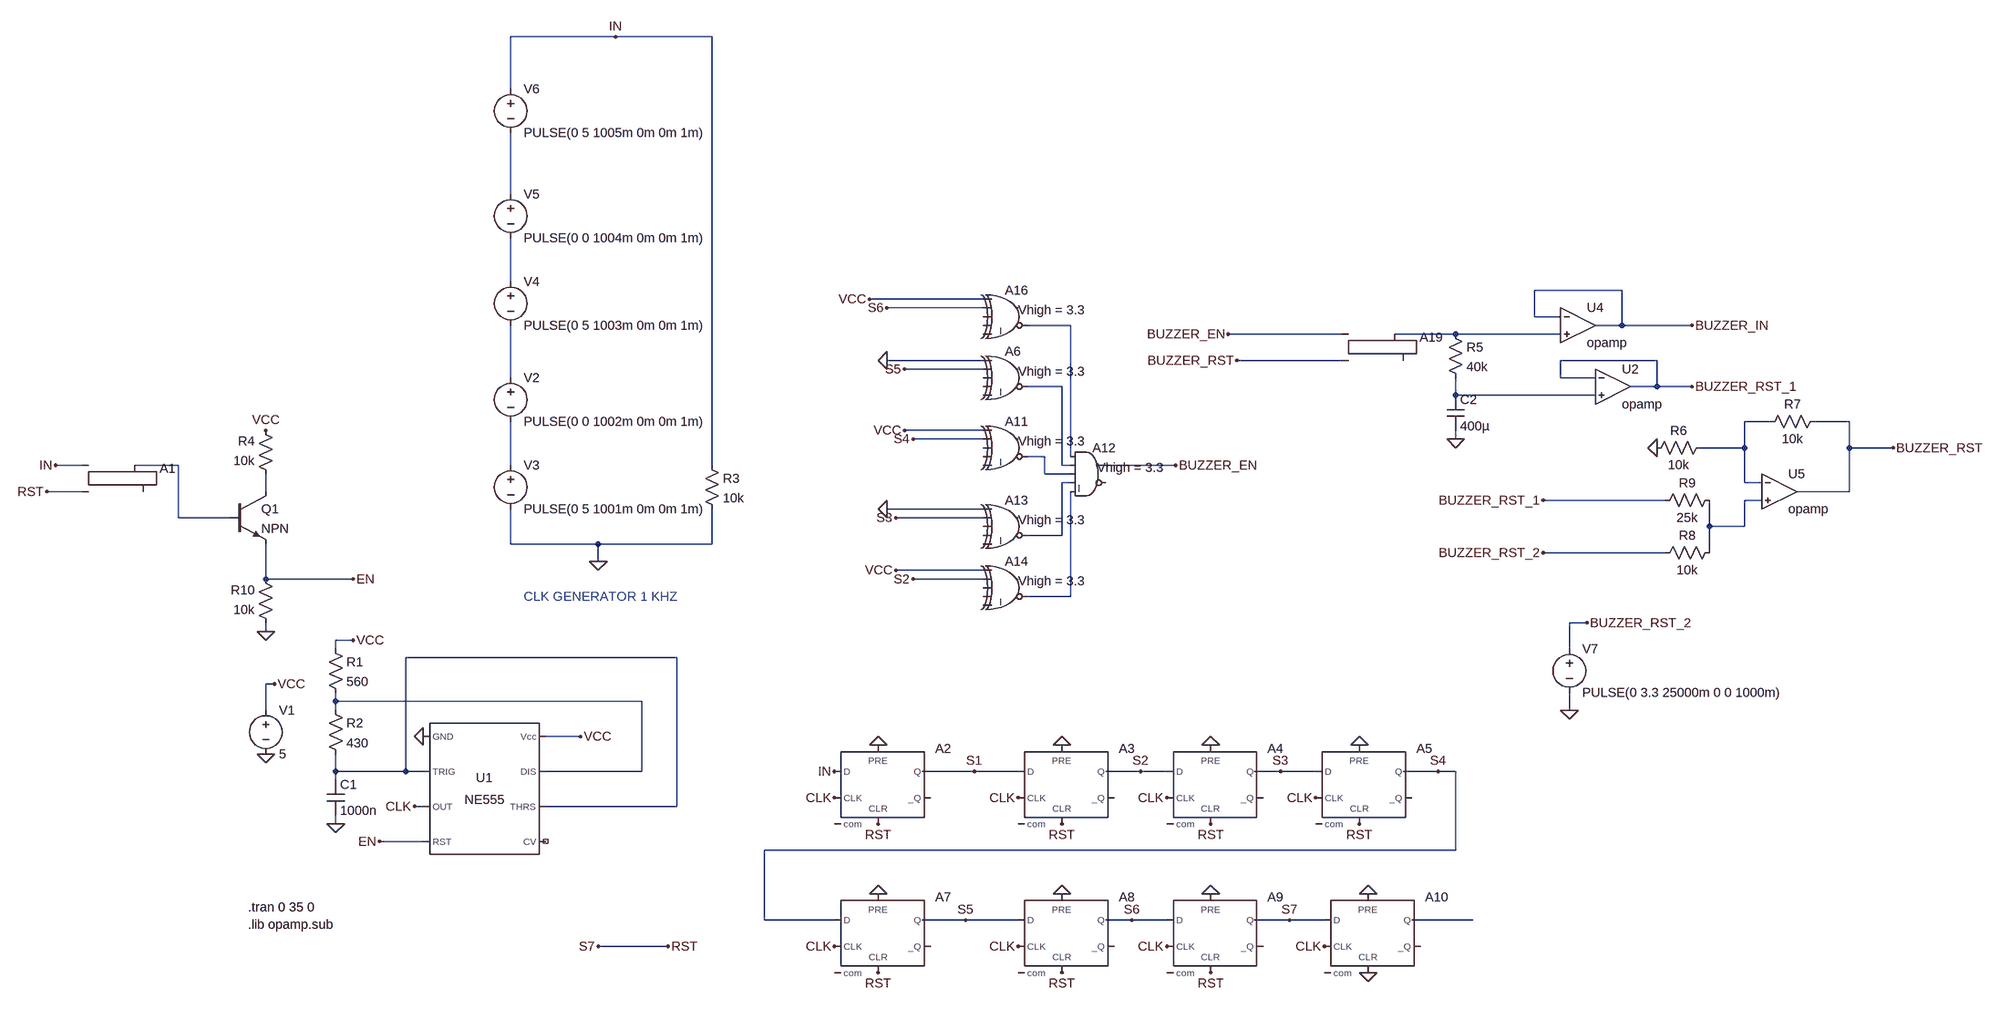
[diagram p0: schematic Draft1.asc]
Draft1.asc, the LTspice schematic file:
Version 4
SHEET 1 2968 680
WIRE 464 -1200 272 -1200
WIRE 640 -1200 464 -1200
WIRE 272 -1104 272 -1200
WIRE 272 -912 272 -1024
WIRE 272 -752 272 -832
WIRE 2304 -736 2144 -736
WIRE 1136 -720 928 -720
WIRE 1136 -704 960 -704
WIRE 2144 -688 2144 -736
WIRE 2192 -688 2144 -688
WIRE 1296 -672 1216 -672
WIRE 2304 -672 2304 -736
WIRE 2304 -672 2256 -672
WIRE 2432 -672 2304 -672
WIRE 1792 -656 1584 -656
WIRE 2000 -656 1888 -656
WIRE 2192 -656 2000 -656
WIRE 1136 -608 960 -608
WIRE 1792 -608 1600 -608
WIRE 2368 -608 2192 -608
WIRE 1136 -592 992 -592
WIRE 272 -576 272 -672
WIRE 2192 -576 2192 -608
WIRE 2256 -576 2192 -576
WIRE 1280 -560 1216 -560
WIRE 2368 -560 2368 -608
WIRE 2368 -560 2320 -560
WIRE 2432 -560 2368 -560
WIRE 2000 -544 2000 -576
WIRE 2256 -544 2000 -544
WIRE 2576 -496 2528 -496
WIRE 2720 -496 2656 -496
WIRE 1136 -480 992 -480
WIRE 1136 -464 1008 -464
WIRE 2000 -464 2000 -480
WIRE 2528 -448 2528 -496
WIRE 2528 -448 2448 -448
WIRE 2720 -448 2720 -496
WIRE 2800 -448 2720 -448
WIRE 1248 -432 1216 -432
WIRE 1296 -432 1296 -672
WIRE -512 -416 -560 -416
WIRE -336 -416 -416 -416
WIRE 272 -416 272 -496
WIRE 640 -416 640 -1200
WIRE 1280 -416 1280 -560
WIRE 1296 -416 1280 -416
WIRE 1488 -416 1360 -416
WIRE 1248 -400 1248 -432
WIRE 1296 -400 1248 -400
WIRE 1296 -384 1280 -384
WIRE 2528 -384 2528 -448
WIRE 2560 -384 2528 -384
WIRE -512 -368 -576 -368
WIRE -176 -368 -176 -400
WIRE 2720 -368 2720 -448
WIRE 2720 -368 2624 -368
WIRE 2384 -352 2160 -352
WIRE 2560 -352 2528 -352
WIRE 1136 -336 960 -336
WIRE -336 -320 -336 -416
WIRE -240 -320 -336 -320
WIRE 1136 -320 976 -320
WIRE 2464 -304 2464 -352
WIRE 2528 -304 2528 -352
WIRE 2528 -304 2464 -304
WIRE 1280 -288 1280 -384
WIRE 1280 -288 1216 -288
WIRE 272 -272 272 -336
WIRE 432 -272 272 -272
WIRE 640 -272 640 -336
WIRE 640 -272 432 -272
WIRE 2384 -256 2160 -256
WIRE 2464 -256 2464 -304
WIRE 432 -240 432 -272
WIRE 1136 -224 976 -224
WIRE -176 -208 -176 -272
WIRE -16 -208 -176 -208
WIRE 1136 -208 1008 -208
WIRE 1296 -176 1296 -368
WIRE 1296 -176 1216 -176
WIRE 2240 -128 2208 -128
WIRE -176 -112 -176 -128
WIRE -16 -96 -48 -96
WIRE -48 -80 -48 -96
WIRE 2208 -80 2208 -128
WIRE 576 -64 80 -64
WIRE -160 -16 -176 -16
WIRE -48 16 -48 0
WIRE 512 16 -48 16
WIRE -176 32 -176 -16
WIRE -48 32 -48 16
WIRE 2208 32 2208 0
WIRE 400 80 336 80
WIRE -48 144 -48 112
WIRE 80 144 80 -64
WIRE 80 144 -48 144
WIRE 112 144 80 144
WIRE 512 144 512 16
WIRE 512 144 336 144
WIRE 1120 144 1024 144
WIRE 1200 144 1120 144
WIRE 1424 144 1360 144
WIRE 1472 144 1424 144
WIRE 1680 144 1632 144
WIRE 1744 144 1680 144
WIRE 1968 144 1904 144
WIRE 2000 144 1968 144
WIRE -48 160 -48 144
WIRE 112 208 96 208
WIRE 576 208 576 -64
WIRE 576 208 336 208
WIRE -48 240 -48 224
WIRE 112 272 32 272
WIRE 2000 288 2000 144
WIRE 2000 288 736 288
WIRE 736 416 736 288
WIRE 864 416 736 416
WIRE 1104 416 1024 416
WIRE 1200 416 1104 416
WIRE 1408 416 1360 416
WIRE 1472 416 1408 416
WIRE 1696 416 1632 416
WIRE 1760 416 1696 416
WIRE 2032 416 1920 416
WIRE 560 464 432 464
FLAG -176 112 0
FLAG -160 -16 VCC
FLAG 96 208 CLK
FLAG -560 -416 IN
FLAG 432 -240 0
FLAG 464 -1200 IN
FLAG -16 -96 VCC
FLAG 400 80 VCC
FLAG 32 272 EN
FLAG 864 192 CLK
FLAG 1200 192 CLK
FLAG 1472 192 CLK
FLAG 1744 192 CLK
FLAG 864 464 CLK
FLAG 1200 464 CLK
FLAG 1472 464 CLK
FLAG 1760 464 CLK
FLAG 864 144 IN
FLAG 944 240 RST
FLAG 1280 240 RST
FLAG 1552 240 RST
FLAG 1824 240 RST
FLAG 1840 512 0
FLAG 1552 512 RST
FLAG 1280 512 RST
FLAG 944 512 RST
FLAG 944 96 0
FLAG 1280 96 0
FLAG 1552 96 0
FLAG 1824 96 0
FLAG 944 368 0
FLAG 1280 368 0
FLAG 1552 368 0
FLAG 1840 368 0
FLAG -48 240 0
FLAG 112 80 0
FLAG 1680 144 S3
FLAG 1104 416 S5
FLAG 1408 416 S6
FLAG 1696 416 S7
FLAG 1968 144 S4
FLAG -16 -208 EN
FLAG -176 -112 0
FLAG -176 -480 VCC
FLAG 1424 144 S2
FLAG 1120 144 S1
FLAG 1008 -208 S2
FLAG 976 -320 S3
FLAG 992 -592 S5
FLAG 960 -704 S6
FLAG 928 -720 VCC
FLAG 992 -480 VCC
FLAG 976 -224 VCC
FLAG 960 -608 0
FLAG 960 -336 0
FLAG 432 464 S7
FLAG 560 464 RST
FLAG -576 -368 RST
FLAG 1008 -464 S4
FLAG 1584 -656 BUZZER_EN
FLAG 2000 -464 0
FLAG 2432 -560 BUZZER_RST_1
FLAG 2432 -672 BUZZER_IN
FLAG 1600 -608 BUZZER_RST
FLAG 2160 -256 BUZZER_RST_2
FLAG 2800 -448 BUZZER_RST
FLAG 2368 -448 0
FLAG 1488 -416 BUZZER_EN
FLAG 2160 -352 BUZZER_RST_1
FLAG 2208 32 0
FLAG 2240 -128 BUZZER_RST_2
SYMBOL Misc\\NE555 224 176 R0
SYMATTR InstName U1
SYMBOL voltage -176 16 R0
WINDOW 123 0 0 Left 0
WINDOW 39 0 0 Left 0
SYMATTR InstName V1
SYMATTR Value 5
SYMBOL cap -64 160 R0
SYMATTR InstName C1
SYMATTR Value 1000n
SYMBOL res -64 -96 R0
SYMATTR InstName R1
SYMATTR Value 560
SYMBOL res -64 16 R0
SYMATTR InstName R2
SYMATTR Value 430
SYMBOL voltage 272 -432 R0
WINDOW 123 0 0 Left 0
WINDOW 39 0 0 Left 0
SYMATTR InstName V3
SYMATTR Value PULSE(0 5 1001m 0m 0m 1m)
SYMBOL res 624 -432 R0
SYMATTR InstName R3
SYMATTR Value 10k
SYMBOL Digital\\srflop -464 -464 R0
SYMATTR InstName A1
SYMBOL Digital\\dflop 944 96 R0
SYMATTR InstName A2
SYMATTR Value2 Vhigh = 3.3 Vlow = 0
SYMATTR SpiceLine Td = 5n
SYMBOL voltage 272 -592 R0
WINDOW 123 0 0 Left 0
WINDOW 39 0 0 Left 0
SYMATTR InstName V2
SYMATTR Value PULSE(0 0 1002m 0m 0m 1m)
SYMBOL voltage 272 -768 R0
WINDOW 123 0 0 Left 0
WINDOW 39 0 0 Left 0
SYMATTR InstName V4
SYMATTR Value PULSE(0 5 1003m 0m 0m 1m)
SYMBOL voltage 272 -928 R0
WINDOW 123 0 0 Left 0
WINDOW 39 0 0 Left 0
SYMATTR InstName V5
SYMATTR Value PULSE(0 0 1004m 0m 0m 1m)
SYMBOL voltage 272 -1120 R0
WINDOW 123 0 0 Left 0
WINDOW 39 0 0 Left 0
SYMATTR InstName V6
SYMATTR Value PULSE(0 5 1005m 0m 0m 1m)
SYMBOL Digital\\and 1328 -464 R0
WINDOW 3 16 52 Left 2
SYMATTR InstName A12
SYMATTR Value Vhigh = 3.3
SYMBOL Digital\\xor 1184 -752 R0
WINDOW 3 16 52 Left 2
SYMATTR Value Vhigh = 3.3
SYMATTR InstName A16
SYMBOL npn -240 -368 R0
SYMATTR InstName Q1
SYMBOL Digital\\dflop 1280 96 R0
SYMATTR InstName A3
SYMATTR Value2 Vhigh = 3.3 Vlow = 0
SYMATTR SpiceLine Td = 5n
SYMBOL Digital\\dflop 1552 96 R0
SYMATTR InstName A4
SYMATTR Value2 Vhigh = 3.3 Vlow = 0
SYMATTR SpiceLine Td = 5n
SYMBOL Digital\\dflop 1824 96 R0
SYMATTR InstName A5
SYMATTR Value2 Vhigh = 3.3 Vlow = 0
SYMATTR SpiceLine Td = 5n
SYMBOL Digital\\dflop 944 368 R0
SYMATTR InstName A7
SYMATTR Value2 Vhigh = 3.3 Vlow = 0
SYMATTR SpiceLine Td = 5n
SYMBOL Digital\\dflop 1280 368 R0
SYMATTR InstName A8
SYMATTR Value2 Vhigh = 3.3 Vlow = 0
SYMATTR SpiceLine Td = 5n
SYMBOL Digital\\dflop 1552 368 R0
SYMATTR InstName A9
SYMATTR Value2 Vhigh = 3.3 Vlow = 0
SYMATTR SpiceLine Td = 5n
SYMBOL Digital\\dflop 1840 368 R0
SYMATTR InstName A10
SYMATTR Value2 Vhigh = 3.3 Vlow = 0
SYMATTR SpiceLine Td = 5n
SYMBOL Digital\\xor 1184 -640 R0
WINDOW 3 16 52 Left 2
SYMATTR Value Vhigh = 3.3
SYMATTR InstName A6
SYMBOL Digital\\xor 1184 -512 R0
WINDOW 3 16 52 Left 2
SYMATTR Value Vhigh = 3.3
SYMATTR InstName A11
SYMBOL Digital\\xor 1184 -368 R0
WINDOW 3 16 52 Left 2
SYMATTR Value Vhigh = 3.3
SYMATTR InstName A13
SYMBOL Digital\\xor 1184 -256 R0
WINDOW 3 16 52 Left 2
SYMATTR Value Vhigh = 3.3
SYMATTR InstName A14
SYMBOL Digital\\srflop 1840 -704 R0
SYMATTR InstName A19
SYMATTR SpiceLine Td = 5n
SYMBOL res 1984 -672 R0
SYMATTR InstName R5
SYMATTR Value 40k
SYMBOL cap 1984 -544 R0
SYMATTR InstName C2
SYMATTR Value 400µ
SYMBOL res 2480 -272 R90
WINDOW 0 0 56 VBottom 2
WINDOW 3 32 56 VTop 2
SYMATTR InstName R8
SYMATTR Value 10k
SYMBOL res 2480 -368 R90
WINDOW 0 0 56 VBottom 2
WINDOW 3 32 56 VTop 2
SYMATTR InstName R9
SYMATTR Value 25k
SYMBOL res 2464 -464 R90
WINDOW 0 0 56 VBottom 2
WINDOW 3 32 56 VTop 2
SYMATTR InstName R6
SYMATTR Value 10k
SYMBOL res 2672 -512 R90
WINDOW 0 0 56 VBottom 2
WINDOW 3 32 56 VTop 2
SYMATTR InstName R7
SYMATTR Value 10k
SYMBOL Opamps\\opamp 2288 -624 R0
SYMATTR InstName U2
SYMBOL Opamps\\opamp 2224 -736 R0
SYMATTR InstName U4
SYMBOL Opamps\\opamp 2592 -432 R0
SYMATTR InstName U5
SYMBOL voltage 2208 -96 R0
WINDOW 123 0 0 Left 0
WINDOW 39 0 0 Left 0
SYMATTR InstName V7
SYMATTR Value PULSE(0 3.3 25000m 0 0 1000m)
SYMBOL res -160 -112 R180
WINDOW 0 36 76 Left 2
WINDOW 3 36 40 Left 2
SYMATTR InstName R10
SYMATTR Value 10k
SYMBOL res -160 -384 R180
WINDOW 0 36 76 Left 2
WINDOW 3 36 40 Left 2
SYMATTR InstName R4
SYMATTR Value 10k
TEXT -208 392 Left 2 !.tran 0 35 0
TEXT 296 -176 Left 2 ;CLK GENERATOR 1 KHZ
TEXT -208 424 Left 2 !.lib opamp.sub

The netlist it stands for:
* Draft1.asc
XU1 0 N016 CLK EN NC_01 N016 N017 VCC NE555  ; pins GND TRIG OUT RST CV THRS DIS Vcc
V1 VCC 0 5
C1 N016 0 1000n
R1 VCC N017 560
R2 N017 N016 430
V3 N011 0 PULSE(0 5 1001m 0m 0m 1m)
R3 IN 0 10k
A1 IN S7 0 0 0 0 N010 0 SRFLOP
A2 IN 0 CLK 0 S7 0 S1 0 DFLOP Vhigh = 3.3 Vlow = 0 Td = 5n
V2 N005 N011 PULSE(0 0 1002m 0m 0m 1m)
V4 N002 N005 PULSE(0 5 1003m 0m 0m 1m)
V5 N001 N002 PULSE(0 0 1004m 0m 0m 1m)
V6 IN N001 PULSE(0 5 1005m 0m 0m 1m)
A12 N003 N006 N009 N012 N015 0 BUZZER_EN 0 AND Vhigh = 3.3
A16 VCC S6 0 0 0 N003 0 0 XOR Vhigh = 3.3
Q1 N013 N010 EN 0 NPN
A3 S1 0 CLK 0 S7 0 S2 0 DFLOP Vhigh = 3.3 Vlow = 0 Td = 5n
A4 S2 0 CLK 0 S7 0 S3 0 DFLOP Vhigh = 3.3 Vlow = 0 Td = 5n
A5 S3 0 CLK 0 S7 0 S4 0 DFLOP Vhigh = 3.3 Vlow = 0 Td = 5n
A7 S4 0 CLK 0 S7 0 S5 0 DFLOP Vhigh = 3.3 Vlow = 0 Td = 5n
A8 S5 0 CLK 0 S7 0 S6 0 DFLOP Vhigh = 3.3 Vlow = 0 Td = 5n
A9 S6 0 CLK 0 S7 0 S7 0 DFLOP Vhigh = 3.3 Vlow = 0 Td = 5n
A10 S7 0 CLK 0 0 0 N018 0 DFLOP Vhigh = 3.3 Vlow = 0 Td = 5n
A6 0 S5 0 0 0 N006 0 0 XOR Vhigh = 3.3
A11 VCC S4 0 0 0 N009 0 0 XOR Vhigh = 3.3
A13 0 S3 0 0 0 N012 0 0 XOR Vhigh = 3.3
A14 VCC S2 0 0 0 N015 0 0 XOR Vhigh = 3.3
A19 BUZZER_EN BUZZER_RST 0 0 0 0 N004 0 SRFLOP Td = 5n
R5 N004 N007 40k
C2 N007 0 400µ
R8 N014 BUZZER_RST_2 10k
R9 N014 BUZZER_RST_1 25k
R6 N008 0 10k
R7 BUZZER_RST N008 10k
XU2 BUZZER_RST_1 N007 BUZZER_RST_1 opamp Aol=100K GBW=10Meg  ; pins invin noninvin out
XU4 BUZZER_IN N004 BUZZER_IN opamp Aol=100K GBW=10Meg  ; pins invin noninvin out
XU5 N008 N014 BUZZER_RST opamp Aol=100K GBW=10Meg  ; pins invin noninvin out
V7 BUZZER_RST_2 0 PULSE(0 3.3 25000m 0 0 1000m)
R10 0 EN 10k
R4 N013 VCC 10k
.model NPN NPN
.model PNP PNP
.lib standard.bjt
.tran 0 35 0
* CLK GENERATOR 1 KHZ
.lib opamp.sub
.lib NE555.sub
.backanno
.end